# EAGLE schematic Tester (EAGLE 6.6.0)
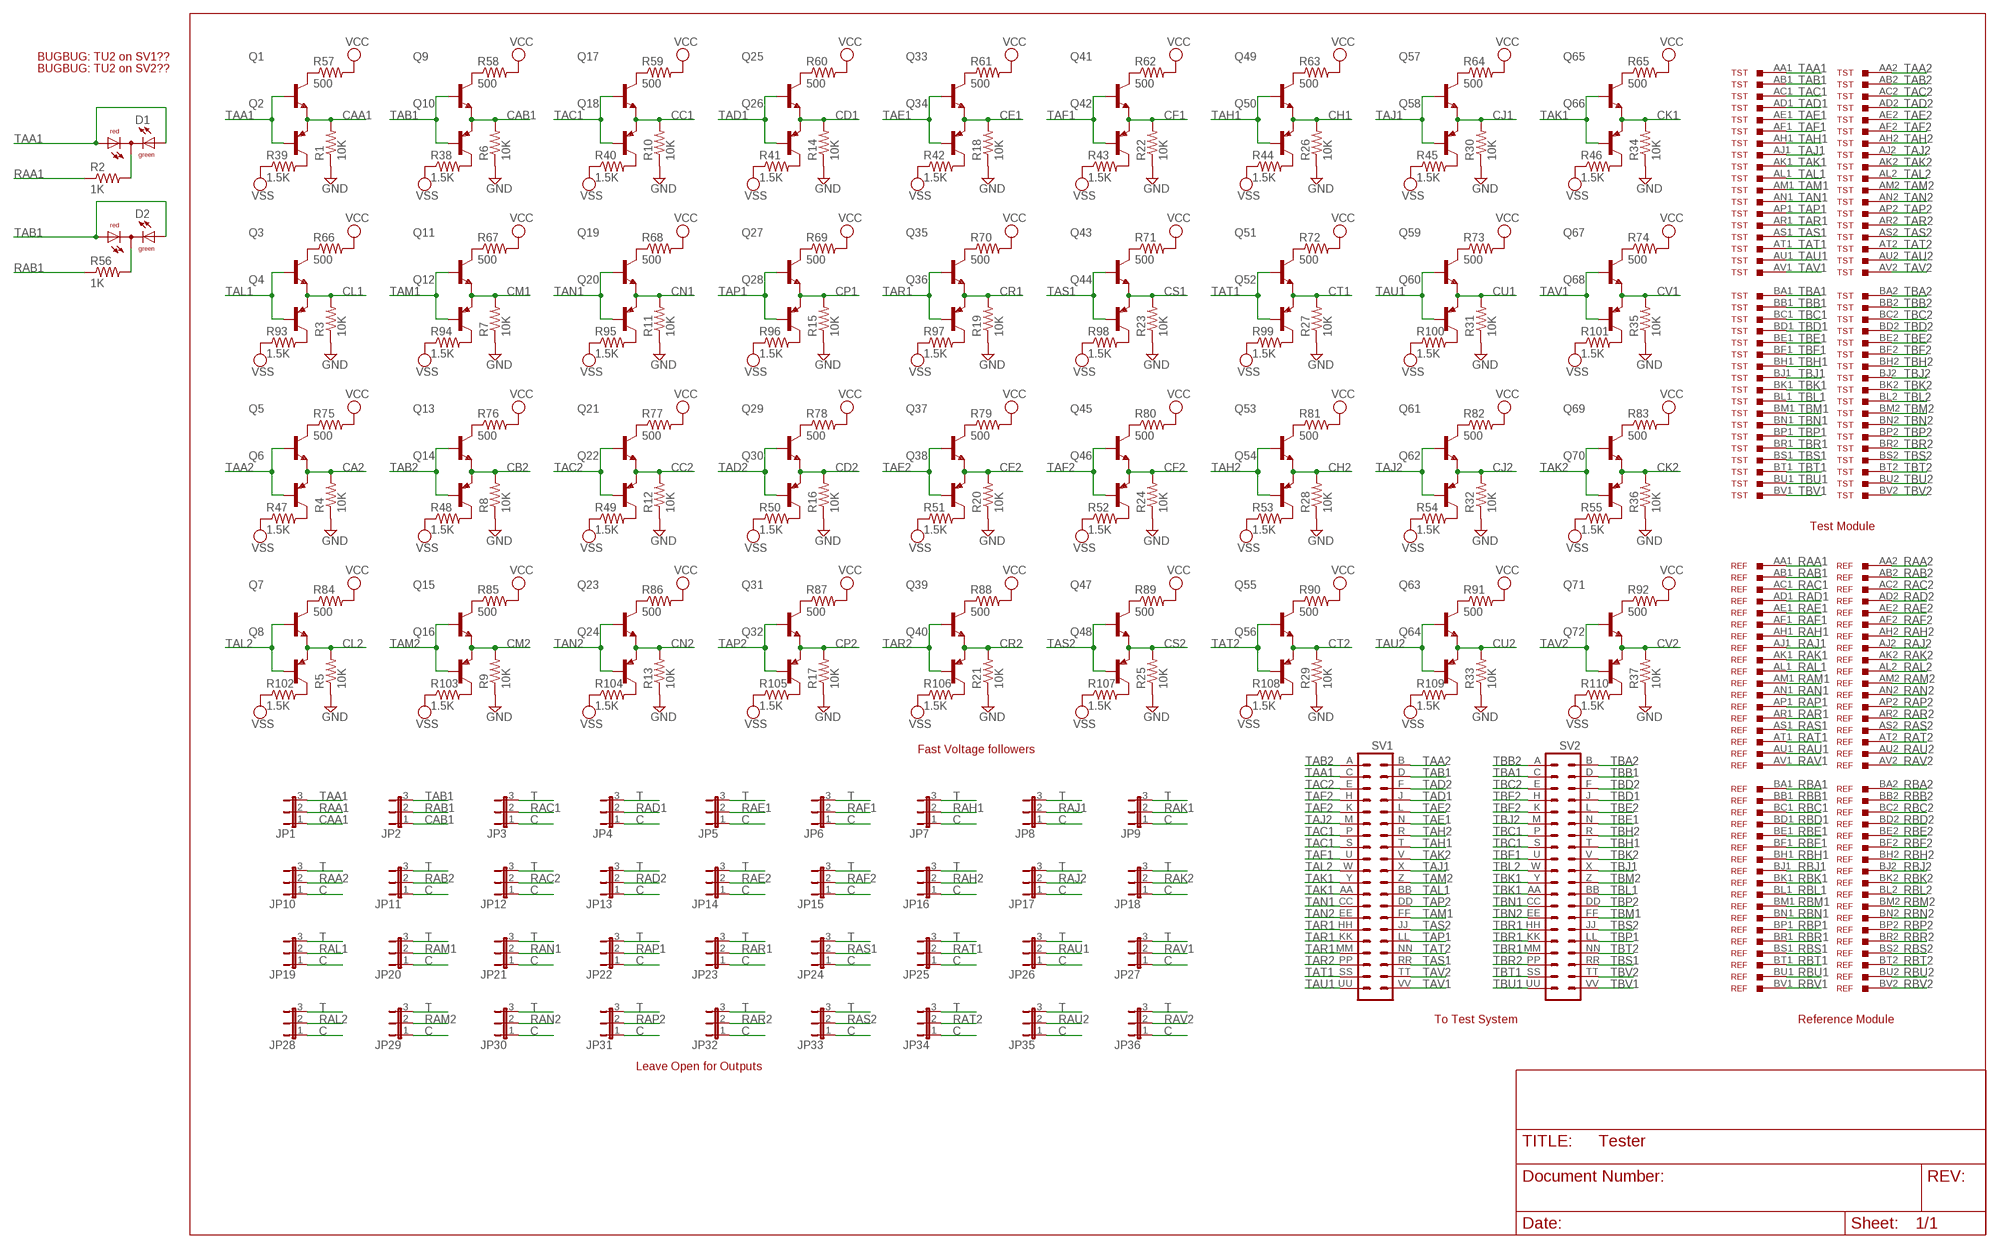
[diagram p0: schematic, sheet 1]

## Parts
D1  DUOLED5MM  [DUOLED5MM]
D2  DUOLED5MM  [DUOLED5MM]
JP1  JP2E  [JP2]
JP2  JP2E  [JP2]
JP3  JP2E  [JP2]
JP4  JP2E  [JP2]
JP5  JP2E  [JP2]
JP6  JP2E  [JP2]
JP7  JP2E  [JP2]
JP8  JP2E  [JP2]
JP9  JP2E  [JP2]
JP10  JP2E  [JP2]
JP11  JP2E  [JP2]
JP12  JP2E  [JP2]
JP13  JP2E  [JP2]
JP14  JP2E  [JP2]
JP15  JP2E  [JP2]
JP16  JP2E  [JP2]
JP17  JP2E  [JP2]
JP18  JP2E  [JP2]
JP19  JP2E  [JP2]
JP20  JP2E  [JP2]
JP21  JP2E  [JP2]
JP22  JP2E  [JP2]
JP23  JP2E  [JP2]
JP24  JP2E  [JP2]
JP25  JP2E  [JP2]
JP26  JP2E  [JP2]
JP27  JP2E  [JP2]
JP28  JP2E  [JP2]
JP29  JP2E  [JP2]
JP30  JP2E  [JP2]
JP31  JP2E  [JP2]
JP32  JP2E  [JP2]
JP33  JP2E  [JP2]
JP34  JP2E  [JP2]
JP35  JP2E  [JP2]
JP36  JP2E  [JP2]
Q1  -NPN-TO5  [TO5]
Q2  -PNP-TO5  [TO5]
Q3  -NPN-TO5  [TO5]
Q4  -PNP-TO5  [TO5]
Q5  -NPN-TO5  [TO5]
Q6  -PNP-TO5  [TO5]
Q7  -NPN-TO5  [TO5]
Q8  -PNP-TO5  [TO5]
Q9  -NPN-TO5  [TO5]
Q10  -PNP-TO5  [TO5]
Q11  -NPN-TO5  [TO5]
Q12  -PNP-TO5  [TO5]
Q13  -NPN-TO5  [TO5]
Q14  -PNP-TO5  [TO5]
Q15  -NPN-TO5  [TO5]
Q16  -PNP-TO5  [TO5]
Q17  -NPN-TO5  [TO5]
Q18  -PNP-TO5  [TO5]
Q19  -NPN-TO5  [TO5]
Q20  -PNP-TO5  [TO5]
Q21  -NPN-TO5  [TO5]
Q22  -PNP-TO5  [TO5]
Q23  -NPN-TO5  [TO5]
Q24  -PNP-TO5  [TO5]
Q25  -NPN-TO5  [TO5]
Q26  -PNP-TO5  [TO5]
Q27  -NPN-TO5  [TO5]
Q28  -PNP-TO5  [TO5]
Q29  -NPN-TO5  [TO5]
Q30  -PNP-TO5  [TO5]
Q31  -NPN-TO5  [TO5]
Q32  -PNP-TO5  [TO5]
Q33  -NPN-TO5  [TO5]
Q34  -PNP-TO5  [TO5]
Q35  -NPN-TO5  [TO5]
Q36  -PNP-TO5  [TO5]
Q37  -NPN-TO5  [TO5]
Q38  -PNP-TO5  [TO5]
Q39  -NPN-TO5  [TO5]
Q40  -PNP-TO5  [TO5]
Q41  -NPN-TO5  [TO5]
Q42  -PNP-TO5  [TO5]
Q43  -NPN-TO5  [TO5]
Q44  -PNP-TO5  [TO5]
Q45  -NPN-TO5  [TO5]
Q46  -PNP-TO5  [TO5]
Q47  -NPN-TO5  [TO5]
Q48  -PNP-TO5  [TO5]
Q49  -NPN-TO5  [TO5]
Q50  -PNP-TO5  [TO5]
Q51  -NPN-TO5  [TO5]
Q52  -PNP-TO5  [TO5]
Q53  -NPN-TO5  [TO5]
Q54  -PNP-TO5  [TO5]
Q55  -NPN-TO5  [TO5]
Q56  -PNP-TO5  [TO5]
Q57  -NPN-TO5  [TO5]
Q58  -PNP-TO5  [TO5]
Q59  -NPN-TO5  [TO5]
Q60  -PNP-TO5  [TO5]
Q61  -NPN-TO5  [TO5]
Q62  -PNP-TO5  [TO5]
Q63  -NPN-TO5  [TO5]
Q64  -PNP-TO5  [TO5]
Q65  -NPN-TO5  [TO5]
Q66  -PNP-TO5  [TO5]
Q67  -NPN-TO5  [TO5]
Q68  -PNP-TO5  [TO5]
Q69  -NPN-TO5  [TO5]
Q70  -PNP-TO5  [TO5]
Q71  -NPN-TO5  [TO5]
Q72  -PNP-TO5  [TO5]
R1  10K  R-US_0207/10  [0207/10]
R2  1K  R-US_0207/10  [0207/10]
R3  10K  R-US_0207/10  [0207/10]
R4  10K  R-US_0207/10  [0207/10]
R5  10K  R-US_0207/10  [0207/10]
R6  10K  R-US_0207/10  [0207/10]
R7  10K  R-US_0207/10  [0207/10]
R8  10K  R-US_0207/10  [0207/10]
R9  10K  R-US_0207/10  [0207/10]
R10  10K  R-US_0207/10  [0207/10]
R11  10K  R-US_0207/10  [0207/10]
R12  10K  R-US_0207/10  [0207/10]
R13  10K  R-US_0207/10  [0207/10]
R14  10K  R-US_0207/10  [0207/10]
R15  10K  R-US_0207/10  [0207/10]
R16  10K  R-US_0207/10  [0207/10]
R17  10K  R-US_0207/10  [0207/10]
R18  10K  R-US_0207/10  [0207/10]
R19  10K  R-US_0207/10  [0207/10]
R20  10K  R-US_0207/10  [0207/10]
R21  10K  R-US_0207/10  [0207/10]
R22  10K  R-US_0207/10  [0207/10]
R23  10K  R-US_0207/10  [0207/10]
R24  10K  R-US_0207/10  [0207/10]
R25  10K  R-US_0207/10  [0207/10]
R26  10K  R-US_0207/10  [0207/10]
R27  10K  R-US_0207/10  [0207/10]
R28  10K  R-US_0207/10  [0207/10]
R29  10K  R-US_0207/10  [0207/10]
R30  10K  R-US_0207/10  [0207/10]
R31  10K  R-US_0207/10  [0207/10]
R32  10K  R-US_0207/10  [0207/10]
R33  10K  R-US_0207/10  [0207/10]
R34  10K  R-US_0207/10  [0207/10]
R35  10K  R-US_0207/10  [0207/10]
R36  10K  R-US_0207/10  [0207/10]
R37  10K  R-US_0207/10  [0207/10]
R38  1.5K  R-US_0207/10  [0207/10]
R39  1.5K  R-US_0207/10  [0207/10]
R40  1.5K  R-US_0207/10  [0207/10]
R41  1.5K  R-US_0207/10  [0207/10]
R42  1.5K  R-US_0207/10  [0207/10]
R43  1.5K  R-US_0207/10  [0207/10]
R44  1.5K  R-US_0207/10  [0207/10]
R45  1.5K  R-US_0207/10  [0207/10]
R46  1.5K  R-US_0207/10  [0207/10]
R47  1.5K  R-US_0207/10  [0207/10]
R48  1.5K  R-US_0207/10  [0207/10]
R49  1.5K  R-US_0207/10  [0207/10]
R50  1.5K  R-US_0207/10  [0207/10]
R51  1.5K  R-US_0207/10  [0207/10]
R52  1.5K  R-US_0207/10  [0207/10]
R53  1.5K  R-US_0207/10  [0207/10]
R54  1.5K  R-US_0207/10  [0207/10]
R55  1.5K  R-US_0207/10  [0207/10]
R56  1K  R-US_0207/10  [0207/10]
R57  500  R-US_0207/10  [0207/10]
R58  500  R-US_0207/10  [0207/10]
R59  500  R-US_0207/10  [0207/10]
R60  500  R-US_0207/10  [0207/10]
R61  500  R-US_0207/10  [0207/10]
R62  500  R-US_0207/10  [0207/10]
R63  500  R-US_0207/10  [0207/10]
R64  500  R-US_0207/10  [0207/10]
R65  500  R-US_0207/10  [0207/10]
R66  500  R-US_0207/10  [0207/10]
R67  500  R-US_0207/10  [0207/10]
R68  500  R-US_0207/10  [0207/10]
R69  500  R-US_0207/10  [0207/10]
R70  500  R-US_0207/10  [0207/10]
R71  500  R-US_0207/10  [0207/10]
R72  500  R-US_0207/10  [0207/10]
R73  500  R-US_0207/10  [0207/10]
R74  500  R-US_0207/10  [0207/10]
R75  500  R-US_0207/10  [0207/10]
R76  500  R-US_0207/10  [0207/10]
R77  500  R-US_0207/10  [0207/10]
R78  500  R-US_0207/10  [0207/10]
R79  500  R-US_0207/10  [0207/10]
R80  500  R-US_0207/10  [0207/10]
R81  500  R-US_0207/10  [0207/10]
R82  500  R-US_0207/10  [0207/10]
R83  500  R-US_0207/10  [0207/10]
R84  500  R-US_0207/10  [0207/10]
R85  500  R-US_0207/10  [0207/10]
R86  500  R-US_0207/10  [0207/10]
R87  500  R-US_0207/10  [0207/10]
R88  500  R-US_0207/10  [0207/10]
R89  500  R-US_0207/10  [0207/10]
R90  500  R-US_0207/10  [0207/10]
R91  500  R-US_0207/10  [0207/10]
R92  500  R-US_0207/10  [0207/10]
R93  1.5K  R-US_0207/10  [0207/10]
R94  1.5K  R-US_0207/10  [0207/10]
R95  1.5K  R-US_0207/10  [0207/10]
R96  1.5K  R-US_0207/10  [0207/10]
R97  1.5K  R-US_0207/10  [0207/10]
R98  1.5K  R-US_0207/10  [0207/10]
R99  1.5K  R-US_0207/10  [0207/10]
R100  1.5K  R-US_0207/10  [0207/10]
R101  1.5K  R-US_0207/10  [0207/10]
R102  1.5K  R-US_0207/10  [0207/10]
R103  1.5K  R-US_0207/10  [0207/10]
R104  1.5K  R-US_0207/10  [0207/10]
R105  1.5K  R-US_0207/10  [0207/10]
R106  1.5K  R-US_0207/10  [0207/10]
R107  1.5K  R-US_0207/10  [0207/10]
R108  1.5K  R-US_0207/10  [0207/10]
R109  1.5K  R-US_0207/10  [0207/10]
R110  1.5K  R-US_0207/10  [0207/10]
REF  W971  [H807-2]
SV1  DEC40PINV  [DEC40PINV]
SV2  DEC40PINV  [DEC40PINV]
TST  W971  [H807-2]

## Nets
C: JP3.1 JP4.1 JP5.1 JP6.1 JP7.1 JP8.1 JP9.1 JP10.1 JP11.1 JP12.1 JP13.1 JP14.1 JP15.1 JP16.1 JP17.1 JP18.1 JP19.1 JP20.1 JP21.1 JP22.1 JP23.1 JP24.1 JP25.1 JP26.1 JP27.1 JP28.1 JP29.1 JP30.1 JP31.1 JP32.1 JP33.1 JP34.1 JP35.1 JP36.1
CA2: Q5.1(E) Q6.1(E) R4.2
CAA1: JP1.1 Q1.1(E) Q2.1(E) R1.2
CAB1: JP2.1 Q9.1(E) Q10.1(E) R6.2
CB2: Q13.1(E) Q14.1(E) R8.2
CC1: Q17.1(E) Q18.1(E) R10.2
CC2: Q21.1(E) Q22.1(E) R12.2
CD1: Q25.1(E) Q26.1(E) R14.2
CD2: Q29.1(E) Q30.1(E) R16.2
CE1: Q33.1(E) Q34.1(E) R18.2
CE2: Q37.1(E) Q38.1(E) R20.2
CF1: Q41.1(E) Q42.1(E) R22.2
CF2: Q45.1(E) Q46.1(E) R24.2
CH1: Q49.1(E) Q50.1(E) R26.2
CH2: Q53.1(E) Q54.1(E) R28.2
CJ1: Q57.1(E) Q58.1(E) R30.2
CJ2: Q61.1(E) Q62.1(E) R32.2
CK1: Q65.1(E) Q66.1(E) R34.2
CK2: Q69.1(E) Q70.1(E) R36.2
CL1: Q3.1(E) Q4.1(E) R3.2
CL2: Q7.1(E) Q8.1(E) R5.2
CM1: Q11.1(E) Q12.1(E) R7.2
CM2: Q15.1(E) Q16.1(E) R9.2
CN1: Q19.1(E) Q20.1(E) R11.2
CN2: Q23.1(E) Q24.1(E) R13.2
CP1: Q27.1(E) Q28.1(E) R15.2
CP2: Q31.1(E) Q32.1(E) R17.2
CR1: Q35.1(E) Q36.1(E) R19.2
CR2: Q39.1(E) Q40.1(E) R21.2
CS1: Q43.1(E) Q44.1(E) R23.2
CS2: Q47.1(E) Q48.1(E) R25.2
CT1: Q51.1(E) Q52.1(E) R27.2
CT2: Q55.1(E) Q56.1(E) R29.2
CU1: Q59.1(E) Q60.1(E) R31.2
CU2: Q63.1(E) Q64.1(E) R33.2
CV1: Q67.1(E) Q68.1(E) R35.2
CV2: Q71.1(E) Q72.1(E) R37.2
GND: R1.1 R3.1 R4.1 R5.1 R6.1 R7.1 R8.1 R9.1 R10.1 R11.1 R12.1 R13.1 R14.1 R15.1 R16.1 R17.1 R18.1 R19.1 R20.1 R21.1 R22.1 R23.1 R24.1 R25.1 R26.1 R27.1 R28.1 R29.1 R30.1 R31.1 R32.1 R33.1 R34.1 R35.1 R36.1 R37.1
N$1: D1.K(C) R2.2
N$2: Q2.3(C) R39.2
N$3: Q1.3(C) R57.1
N$4: Q9.3(C) R58.1
N$5: Q17.3(C) R59.1
N$6: Q25.3(C) R60.1
N$7: Q33.3(C) R61.1
N$8: Q41.3(C) R62.1
N$9: Q49.3(C) R63.1
N$10: Q57.3(C) R64.1
N$11: Q65.3(C) R65.1
N$12: Q10.3(C) R38.2
N$13: Q18.3(C) R40.2
N$14: Q26.3(C) R41.2
N$15: Q34.3(C) R42.2
N$16: Q42.3(C) R43.2
N$17: Q50.3(C) R44.2
N$18: Q58.3(C) R45.2
N$19: Q66.3(C) R46.2
N$20: Q6.3(C) R47.2
N$21: Q4.3(C) R93.2
N$22: Q12.3(C) R94.2
N$23: Q14.3(C) R48.2
N$24: Q22.3(C) R49.2
N$25: Q20.3(C) R95.2
N$26: Q28.3(C) R96.2
N$27: Q30.3(C) R50.2
N$28: Q38.3(C) R51.2
N$29: Q36.3(C) R97.2
N$30: Q44.3(C) R98.2
N$31: Q46.3(C) R52.2
N$32: Q54.3(C) R53.2
N$33: Q52.3(C) R99.2
N$34: Q60.3(C) R100.2
N$35: Q62.3(C) R54.2
N$36: Q70.3(C) R55.2
N$37: Q68.3(C) R101.2
N$38: D2.K(C) R56.2
N$39: Q8.3(C) R102.2
N$40: Q16.3(C) R103.2
N$41: Q24.3(C) R104.2
N$42: Q32.3(C) R105.2
N$43: Q40.3(C) R106.2
N$44: Q48.3(C) R107.2
N$45: Q56.3(C) R108.2
N$46: Q64.3(C) R109.2
N$47: Q72.3(C) R110.2
N$48: Q3.3(C) R66.1
N$49: Q11.3(C) R67.1
N$50: Q19.3(C) R68.1
N$51: Q27.3(C) R69.1
N$52: Q35.3(C) R70.1
N$53: Q43.3(C) R71.1
N$54: Q51.3(C) R72.1
N$55: Q59.3(C) R73.1
N$56: Q67.3(C) R74.1
N$57: Q5.3(C) R75.1
N$58: Q13.3(C) R76.1
N$59: Q21.3(C) R77.1
N$60: Q29.3(C) R78.1
N$61: Q37.3(C) R79.1
N$62: Q45.3(C) R80.1
N$63: Q53.3(C) R81.1
N$64: Q61.3(C) R82.1
N$65: Q69.3(C) R83.1
N$66: Q7.3(C) R84.1
N$67: Q15.3(C) R85.1
N$68: Q23.3(C) R86.1
N$69: Q31.3(C) R87.1
N$70: Q39.3(C) R88.1
N$71: Q47.3(C) R89.1
N$72: Q55.3(C) R90.1
N$73: Q63.3(C) R91.1
N$74: Q71.3(C) R92.1
RAA1: JP1.2 R2.1 REF.AA1
RAA2: JP10.2 REF.AA2
RAB1: JP2.2 R56.1 REF.AB1
RAB2: JP11.2 REF.AB2
RAC1: JP3.2 REF.AC1
RAC2: JP12.2 REF.AC2
RAD1: JP4.2 REF.AD1
RAD2: JP13.2 REF.AD2
RAE1: JP5.2 REF.AE1
RAE2: JP14.2 REF.AE2
RAF1: JP6.2 REF.AF1
RAF2: JP15.2 REF.AF2
RAH1: JP7.2 REF.AH1
RAH2: JP16.2 REF.AH2
RAJ1: JP8.2 REF.AJ1
RAJ2: JP17.2 REF.AJ2
RAK1: JP9.2 REF.AK1
RAK2: JP18.2 REF.AK2
RAL1: JP19.2 REF.AL1
RAL2: JP28.2 REF.AL2
RAM1: JP20.2 REF.AM1
RAM2: JP29.2 REF.AM2
RAN1: JP21.2 REF.AN1
RAN2: JP30.2 REF.AN2
RAP1: JP22.2 REF.AP1
RAP2: JP31.2 REF.AP2
RAR1: JP23.2 REF.AR1
RAR2: JP32.2 REF.AR2
RAS1: JP24.2 REF.AS1
RAS2: JP33.2 REF.AS2
RAT1: JP25.2 REF.AT1
RAT2: JP34.2 REF.AT2
RAU1: JP26.2 REF.AU1
RAU2: JP35.2 REF.AU2
RAV1: JP27.2 REF.AV1
RAV2: JP36.2 REF.AV2
RBA1: REF.BA1
RBA2: REF.BA2
RBB1: REF.BB1
RBB2: REF.BB2
RBC1: REF.BC1
RBC2: REF.BC2
RBD1: REF.BD1
RBD2: REF.BD2
RBE1: REF.BE1
RBE2: REF.BE2
RBF1: REF.BF1
RBF2: REF.BF2
RBH1: REF.BH1
RBH2: REF.BH2
RBJ1: REF.BJ1
RBJ2: REF.BJ2
RBK1: REF.BK1
RBK2: REF.BK2
RBL1: REF.BL1
RBL2: REF.BL2
RBM1: REF.BM1
RBM2: REF.BM2
RBN1: REF.BN1
RBN2: REF.BN2
RBP1: REF.BP1
RBP2: REF.BP2
RBR1: REF.BR1
RBR2: REF.BR2
RBS1: REF.BS1
RBS2: REF.BS2
RBT1: REF.BT1
RBT2: REF.BT2
RBU1: REF.BU1
RBU2: REF.BU2
RBV1: REF.BV1
RBV2: REF.BV2
T: JP3.3 JP4.3 JP5.3 JP6.3 JP7.3 JP8.3 JP9.3 JP10.3 JP11.3 JP12.3 JP13.3 JP14.3 JP15.3 JP16.3 JP17.3 JP18.3 JP19.3 JP20.3 JP21.3 JP22.3 JP23.3 JP24.3 JP25.3 JP26.3 JP27.3 JP28.3 JP29.3 JP30.3 JP31.3 JP32.3 JP33.3 JP34.3 JP35.3 JP36.3
TAA1: D1.AG D1.AR JP1.3 Q1.2(B) Q2.2(B) SV1.C TST.AA1
TAA2: Q5.2(B) Q6.2(B) SV1.B TST.AA2
TAB1: D2.AG D2.AR JP2.3 Q9.2(B) Q10.2(B) SV1.D TST.AB1
TAB2: Q13.2(B) Q14.2(B) SV1.A TST.AB2
TAC1: Q17.2(B) Q18.2(B) SV1.P SV1.S TST.AC1
TAC2: Q21.2(B) Q22.2(B) SV1.E TST.AC2
TAD1: Q25.2(B) Q26.2(B) SV1.J TST.AD1
TAD2: Q29.2(B) Q30.2(B) SV1.F TST.AD2
TAE1: Q33.2(B) Q34.2(B) SV1.N TST.AE1
TAE2: Q37.2(B) Q38.2(B) SV1.L TST.AE2
TAF1: Q41.2(B) Q42.2(B) SV1.U TST.AF1
TAF2: Q45.2(B) Q46.2(B) SV1.H SV1.K TST.AF2
TAH1: Q49.2(B) Q50.2(B) SV1.T TST.AH1
TAH2: Q53.2(B) Q54.2(B) SV1.R TST.AH2
TAJ1: Q57.2(B) Q58.2(B) SV1.X TST.AJ1
TAJ2: Q61.2(B) Q62.2(B) SV1.M TST.AJ2
TAK1: Q65.2(B) Q66.2(B) SV1.AA SV1.Y TST.AK1
TAK2: Q69.2(B) Q70.2(B) SV1.V TST.AK2
TAL1: Q3.2(B) Q4.2(B) SV1.BB TST.AL1
TAL2: Q7.2(B) Q8.2(B) SV1.W TST.AL2
TAM1: Q11.2(B) Q12.2(B) SV1.FF TST.AM1
TAM2: Q15.2(B) Q16.2(B) SV1.Z TST.AM2
TAN1: Q19.2(B) Q20.2(B) SV1.CC TST.AN1
TAN2: Q23.2(B) Q24.2(B) SV1.EE TST.AN2
TAP1: Q27.2(B) Q28.2(B) SV1.LL TST.AP1
TAP2: Q31.2(B) Q32.2(B) SV1.DD TST.AP2
TAR1: Q35.2(B) Q36.2(B) SV1.HH SV1.KK SV1.MM TST.AR1
TAR2: Q39.2(B) Q40.2(B) SV1.PP TST.AR2
TAS1: Q43.2(B) Q44.2(B) SV1.RR TST.AS1
TAS2: Q47.2(B) Q48.2(B) SV1.JJ TST.AS2
TAT1: Q51.2(B) Q52.2(B) SV1.SS TST.AT1
TAT2: Q55.2(B) Q56.2(B) SV1.NN TST.AT2
TAU1: Q59.2(B) Q60.2(B) SV1.UU TST.AU1
TAU2: Q63.2(B) Q64.2(B) TST.AU2
TAV1: Q67.2(B) Q68.2(B) SV1.VV TST.AV1
TAV2: Q71.2(B) Q72.2(B) SV1.TT TST.AV2
TBA1: SV2.C TST.BA1
TBA2: SV2.B TST.BA2
TBB1: SV2.D TST.BB1
TBB2: SV2.A TST.BB2
TBC1: SV2.P SV2.S TST.BC1
TBC2: SV2.E TST.BC2
TBD1: SV2.J TST.BD1
TBD2: SV2.F TST.BD2
TBE1: SV2.N TST.BE1
TBE2: SV2.L TST.BE2
TBF1: SV2.U TST.BF1
TBF2: SV2.H SV2.K TST.BF2
TBH1: SV2.T TST.BH1
TBH2: SV2.R TST.BH2
TBJ1: SV2.X TST.BJ1
TBJ2: SV2.M TST.BJ2
TBK1: SV2.AA SV2.Y TST.BK1
TBK2: SV2.V TST.BK2
TBL1: SV2.BB TST.BL1
TBL2: SV2.W TST.BL2
TBM1: SV2.FF TST.BM1
TBM2: SV2.Z TST.BM2
TBN1: SV2.CC TST.BN1
TBN2: SV2.EE TST.BN2
TBP1: SV2.LL TST.BP1
TBP2: SV2.DD TST.BP2
TBR1: SV2.HH SV2.KK SV2.MM TST.BR1
TBR2: SV2.PP TST.BR2
TBS1: SV2.RR TST.BS1
TBS2: SV2.JJ TST.BS2
TBT1: SV2.SS TST.BT1
TBT2: SV2.NN TST.BT2
TBU1: SV2.UU TST.BU1
TBU2: TST.BU2
TBV1: SV2.VV TST.BV1
TBV2: SV2.TT TST.BV2
VCC: R57.2 R58.2 R59.2 R60.2 R61.2 R62.2 R63.2 R64.2 R65.2 R66.2 R67.2 R68.2 R69.2 R70.2 R71.2 R72.2 R73.2 R74.2 R75.2 R76.2 R77.2 R78.2 R79.2 R80.2 R81.2 R82.2 R83.2 R84.2 R85.2 R86.2 R87.2 R88.2 R89.2 R90.2 R91.2 R92.2
VSS: R38.1 R39.1 R40.1 R41.1 R42.1 R43.1 R44.1 R45.1 R46.1 R47.1 R48.1 R49.1 R50.1 R51.1 R52.1 R53.1 R54.1 R55.1 R93.1 R94.1 R95.1 R96.1 R97.1 R98.1 R99.1 R100.1 R101.1 R102.1 R103.1 R104.1 R105.1 R106.1 R107.1 R108.1 R109.1 R110.1

## Notes on the sheet
- BUGBUG: TU2 on SV1??
- BUGBUG: TU2 on SV2??
- Test Module
- Fast Voltage followers
- To Test System | Reference Module
- Leave Open for Outputs

## Library data of the parts
D1 D2 = led:DUOLED5MM: DUO LED 2 colors, 5 mm, round
JP1-JP36 = jumper:JP2E: JUMPER
Q1 Q3 Q5 Q7 Q9 Q11 Q13 Q15 Q17 Q19 Q21 Q23 Q25 Q27 Q29 Q31 Q33 Q35 Q37 Q39 Q41 Q43 Q45 Q47 Q49 Q51 Q53 Q55 Q57 Q59 Q61 Q63 Q65 Q67 Q69 Q71 = transistor:*-NPN-: NPN Transistror BF959 corrected 2008.03.06
Q2 Q4 Q6 Q8 Q10 Q12 Q14 Q16 Q18 Q20 Q22 Q24 Q26 Q28 Q30 Q32 Q34 Q36 Q38 Q40 Q42 Q44 Q46 Q48 Q50 Q52 Q54 Q56 Q58 Q60 Q62 Q64 Q66 Q68 Q70 Q72 = transistor:*-PNP-: PNP Transistror
R1-R110 = rcl:R-US_: RESISTOR, American symbol
REF TST = dec-m:W971: Double sided Double Height Connector, 72 pins
SV1 SV2 = dec-con:DEC40PIN: PIN HEADER